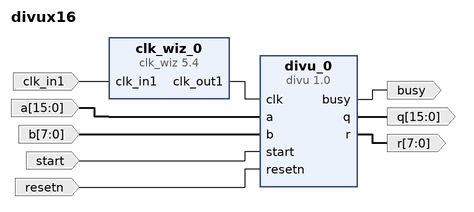
[diagram p0: block diagram of the top level]
# Vivado block design divux16, xc7a100tfgg484-1, Vivado 2017.4
create_bd_design divux16

create_bd_port -dir I -from 15 -to 0 a
create_bd_port -dir I -from 7 -to 0 b
create_bd_port -dir I -type clk clk_in1
set_property -dict {CONFIG.FREQ_HZ 100000000} [get_bd_ports clk_in1]
create_bd_port -dir I start
create_bd_port -dir I -type rst resetn
create_bd_port -dir O -from 7 -to 0 r
create_bd_port -dir O -from 15 -to 0 q
create_bd_port -dir O busy

create_bd_cell -type ip -vlnv xilinx.com:ip:clk_wiz:5.4 clk_wiz_0
set_property -dict [list \
  CONFIG.CLKOUT1_REQUESTED_PHASE 50.000 \
  CONFIG.USE_LOCKED false \
  CONFIG.USE_RESET false \
  CONFIG.MMCM_DIVCLK_DIVIDE 1 \
  CONFIG.MMCM_CLKFBOUT_MULT_F 9.000 \
  CONFIG.MMCM_CLKOUT0_DIVIDE_F 9.000 \
  CONFIG.MMCM_CLKOUT0_PHASE 50.000 \
  CONFIG.CLKOUT1_JITTER 137.681 \
  CONFIG.CLKOUT1_PHASE_ERROR 105.461 \
] [get_bd_cells clk_wiz_0]
create_bd_cell -type ip -vlnv CSE:CSE:divu:1.0 divu_0
set_property -dict {CONFIG.WIDTH 16} [get_bd_cells divu_0]

# ---- connections ----

connect_bd_net [get_bd_pins clk_wiz_0/clk_out1] [get_bd_pins divu_0/clk]
connect_bd_net [get_bd_ports a] [get_bd_pins divu_0/a]
connect_bd_net [get_bd_ports b] [get_bd_pins divu_0/b]
connect_bd_net -net clk_in1_1 [get_bd_ports clk_in1] [get_bd_pins clk_wiz_0/clk_in1]
connect_bd_net [get_bd_ports start] [get_bd_pins divu_0/start]
connect_bd_net [get_bd_ports resetn] [get_bd_pins divu_0/resetn]
connect_bd_net [get_bd_pins divu_0/r] [get_bd_ports r]
connect_bd_net [get_bd_pins divu_0/q] [get_bd_ports q]
connect_bd_net [get_bd_pins divu_0/busy] [get_bd_ports busy]

validate_bd_design
save_bd_design
